# EAGLE design CT Bassline 3.0 (EAGLE 8.3.1)
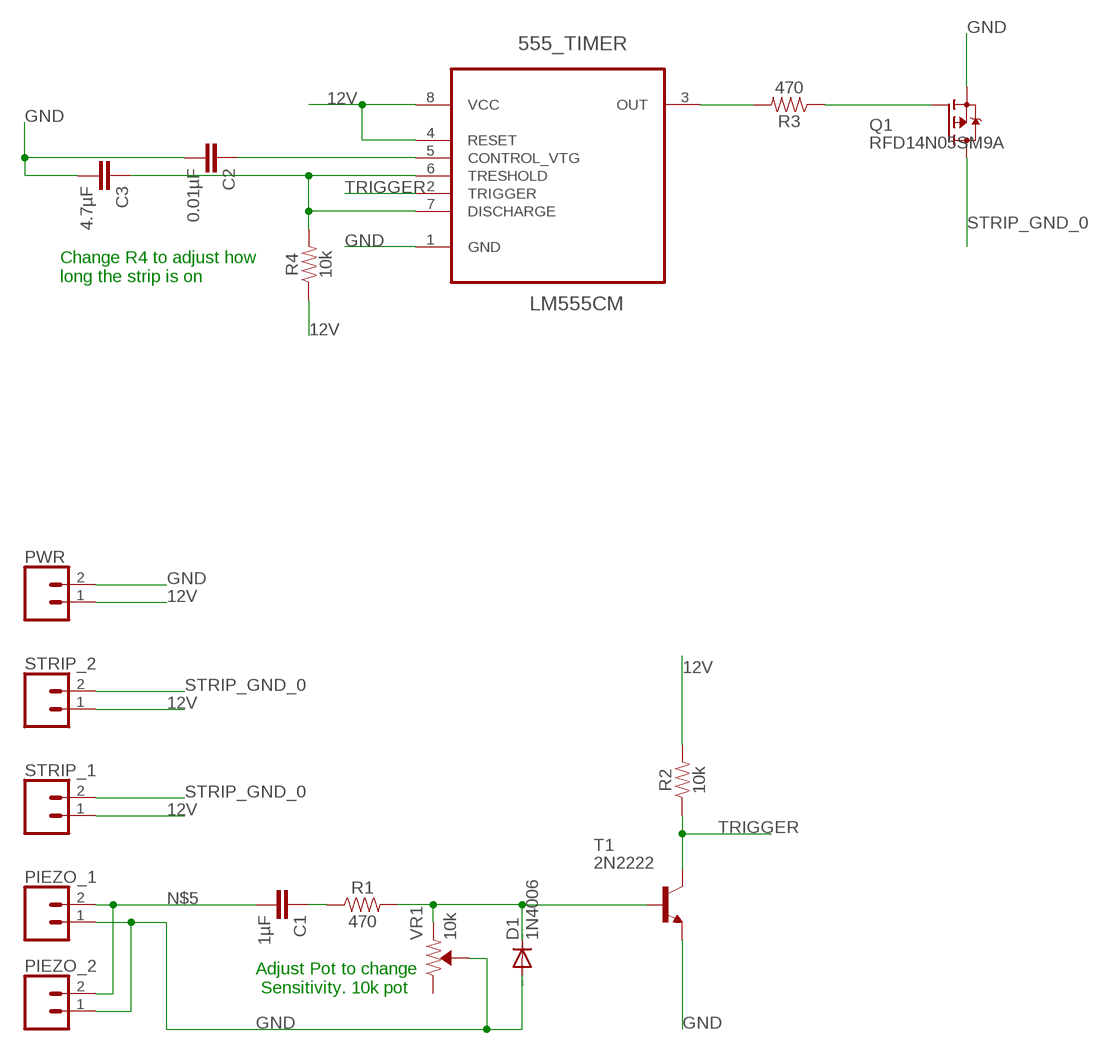
[diagram p0: schematic, sheet 1]

## Parts
555_TIMER  LM555CM  [SOIC127P600X175-8N]
C1  1µF  0.33UF/330NF-0805-50V-10%  [0805]
C2  0.01µF  0.33UF/330NF-0805-50V-10%  [0805]
C3  4.7µF  0.33UF/330NF-0805-50V-10%  [0805]
D1  1N4006  1N4004  [DO41-10]
PIEZO_1  CONN_02  [1X02]
PIEZO_2  CONN_02  [1X02]
PWR  CONN_02  [1X02]
Q1  RFD14N05SM9A  FDD4141TO252  [TO252]
R1  470  0.22OHM-0805-1/4W-1%  [0805]
R2  10k  0.22OHM-0805-1/4W-1%  [0805]
R3  470  0.22OHM-0805-1/4W-1%  [0805]
R4  10k  0.22OHM-0805-1/4W-1%  [0805]
STRIP_1  CONN_02  [1X02]
STRIP_2  CONN_02  [1X02]
T1  2N2222  [TO92-EBC-OVAL]
VR1  10k  TRIMPOT-PTH-10MM-KNOB-1/2W-10%  [TRIMPOT-PTH-3386U]

## Nets
12V: 555_TIMER.4(RESET) 555_TIMER.8(VCC) PWR.1 R2.2 R4.1 STRIP_1.1 STRIP_2.1
GATE: Q1.1(G) R3.1
GND: 555_TIMER.1(GND) C2.2 C3.2 D1.A PIEZO_1.1 PIEZO_2.1 PWR.2 Q1.2(S) T1.E VR1.2(WIPER)
N$1: C1.1 R1.1
N$3: 555_TIMER.3(OUT) R3.2
N$4: 555_TIMER.5(CONTROL_VTG) C2.1
N$5: C1.2 PIEZO_1.2 PIEZO_2.2
N$8: 555_TIMER.6(TRESHOLD) 555_TIMER.7(DISCHARGE) C3.1 R4.2
NO_CONNECT_TO_TRIGGER: D1.C R1.2 T1.B VR1.1(CCW)
STRIP_GND_0: Q1.3(D) STRIP_1.2 STRIP_2.2
TRIGGER: 555_TIMER.2(TRIGGER) R2.1 T1.C
Unconnected: VR1.3(CW)

## Notes on the sheet
- Change R4 to adjust how
  long the strip is on
- Adjust Pot to change
   Sensitivity. 10k pot

## Library data of the parts
555_TIMER = 555-Timer-Fairchild:LM555CM: Single Timer; MPN: LM555CM; OC_FARNELL: -; OC_NEWARK: 78K6011; PACKAGE: SOIC-8; SUPPLIER: FAIRCHILD
C1-C3 = SparkFun-Capacitors:0.33UF/330NF: 0.33µF/330nF ceramic capacitors A capacitor is a passive two-terminal electrical component used to store electrical energy temporarily in an electric field.; PROD_ID: CAP-08469; VALUE: 0.33µF
D1 = diode:1N4004: DIODE general purpose rectifier, 1 A
PIEZO_1 PIEZO_2 PWR STRIP_1 STRIP_2 = SparkFun-Connectors:CONN_02: Multi connection point. Often used as Generic Header-pin footprint for 0.1 inch spaced/style header connections On any of the 0.1 inch spaced packages, you can populate with these: Break Away Headers - Straight <https://www.sparkfun.com/products/116> (PRT-00116) Break Away Male Headers - Right Angle <https://www.sparkfun.com/products/553> (PRT-00553) Female Headers <https://www.sparkfun.com/products/115> (PRT-00115) Break Away Headers - Machine Pin <https://www.sparkfun.com/products/117> (PRT-00117) Break Away Female Headers - Swiss Machine Pin <https://www.sparkfun.com/products/743> (PRT-00743) For SCREWTERMINALS and SPRING TERMINALS visit here: Screw Terimnals on SparkFun.com <https://www.sparkfun.com/search/results?term=Screw+Terminals> (5mm/3.5mm/2.54mm spacing) This device is also useful as a general connection point to wire up your design to another part of your project. Our various solder wires solder well into these plated through hole pads. Hook-Up Wire - Assortment (Stranded, 22 AWG) <https://www.sparkfun.com/products/11375> (PRT-11375) Hook-Up Wire - Assortment (Solid Core, 22 AWG) <https://www.sparkfun.com/products/11367> (PRT-11367) View the entire wire category on our website here <https://www.sparkfun.com/categories/141> Special notes: Molex polarized connector foot print use with: PRT-08233 with associated crimp pins and housings. 2.54_SCREWTERM for use with PRT-10571. 3.5mm Screw Terminal footprints for PRT-08084 5mm Screw Terminal footprints for use with PRT-08432
Q1 = transistor-fet:FDD4141: P-Channel PowerTrench® MOSFET Source: FDD4141.pdf
R1-R4 = SparkFun-Resistors:0.22OHM: 0.22Ω resistor A resistor is a passive two-terminal electrical component that implements electrical resistance as a circuit element. Resistors act to reduce current flow, and, at the same time, act to lower voltage levels within circuits. - Wikipedia; PROD_ID: RES-09883; VALUE: 0.22
T1 = adafruit:2N2222: NPN TRANSISTOR Big oval pads
VR1 = SparkFun-Resistors:TRIMPOT: Trimming Potentiometer (Trimpot) Three-terminal potentiometers, with an adjustable wiper and two adjustable resistors. A pot can be used to create a configurable voltage divider, or as a variable resistor. "Trimpots" are a subset of potentiometers, usually intended for "set-and-forget" applications. They're often more delicate than standard potentiometers - rated for fewer turns. Variants PTH-KNOB - PTH Trimpot w/ finger-adjustable knob Trimpot 10K with Knob <https://www.sparkfun.com/products/9806> (COM-09806) Datasheet <http://www.sparkfun.com/datasheets/Components/General/TSR-3386.pdf> SMD-3MM-CLOSED-FRAME - SMD 3mm Square Closed-Frame Trimpot Used on e.g. EasyDriver - Stepper Motor Driver <https://www.sparkfun.com/products/12779> Datasheet <http://www.bitechnologies.com/pdfs/22.pdf> (22AR10KTR) SMD-5MM - SMD 5mm Square Closed-Frame Trimpot Used on e.g. IOIO-OTG - V2.2 <https://www.sparkfun.com/products/13613> Datasheet <http://www.vishay.com/docs/51008/ts53.pdf> (TS53YL502MR10) SMD-3MM-1/10W-25% - 3mm Square Open-Frame Trimpot Used on e.g. SparkFun Shapeoko <https://www.sparkfun.com/products/13899> Datasheet <http://www.bourns.com/docs/Product-Datasheets/TC33.pdf> (TC33X-2-103E); PROD_ID: RES-09730; SF_SKU: COM-09806

## Board
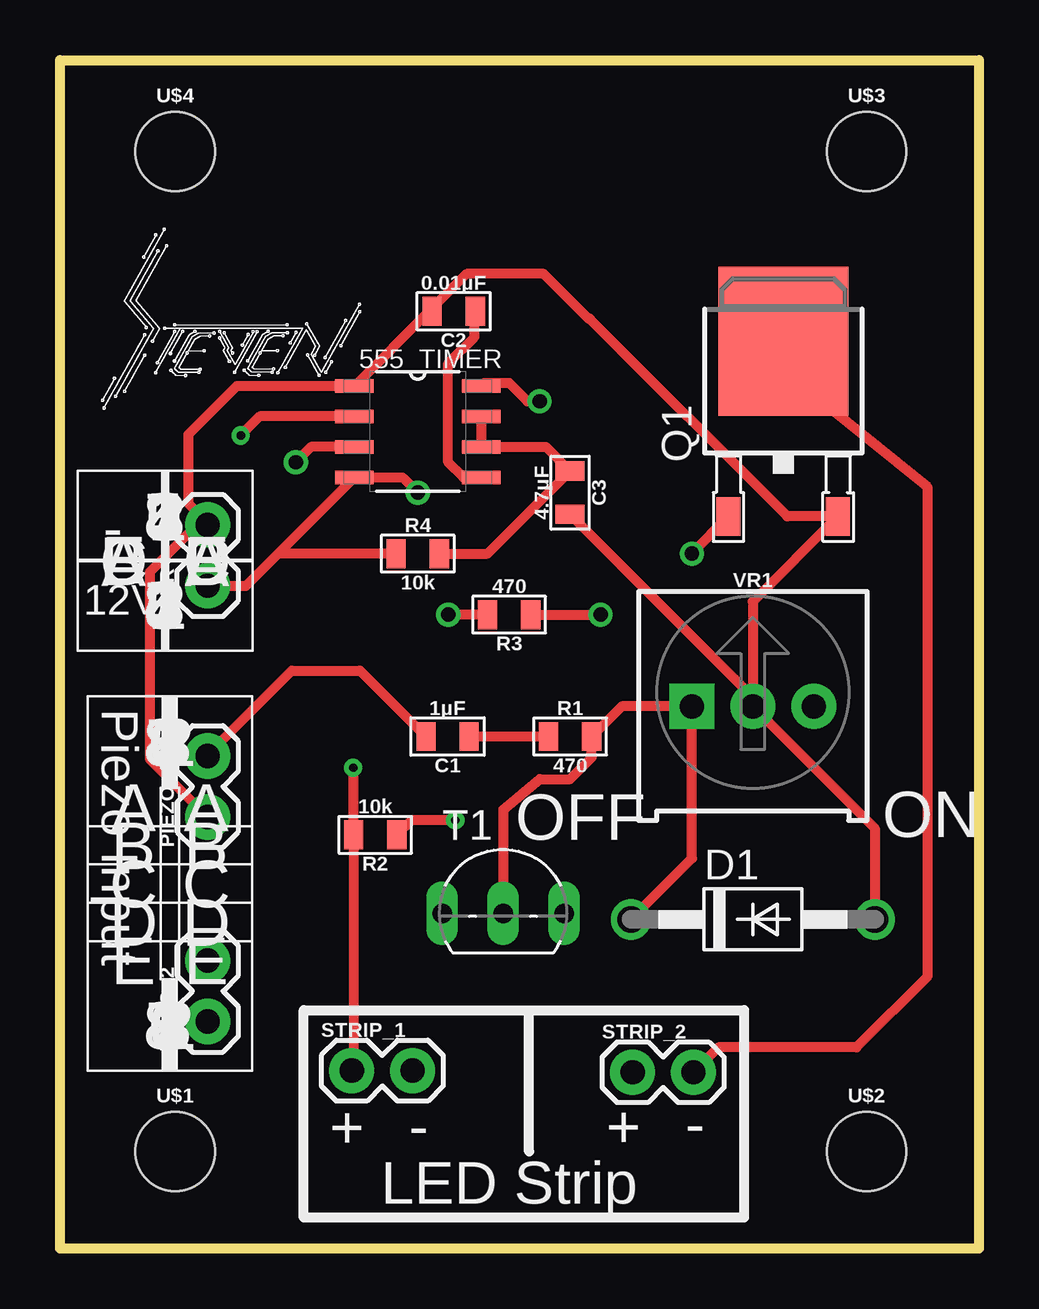
[diagram p1: board, top side]
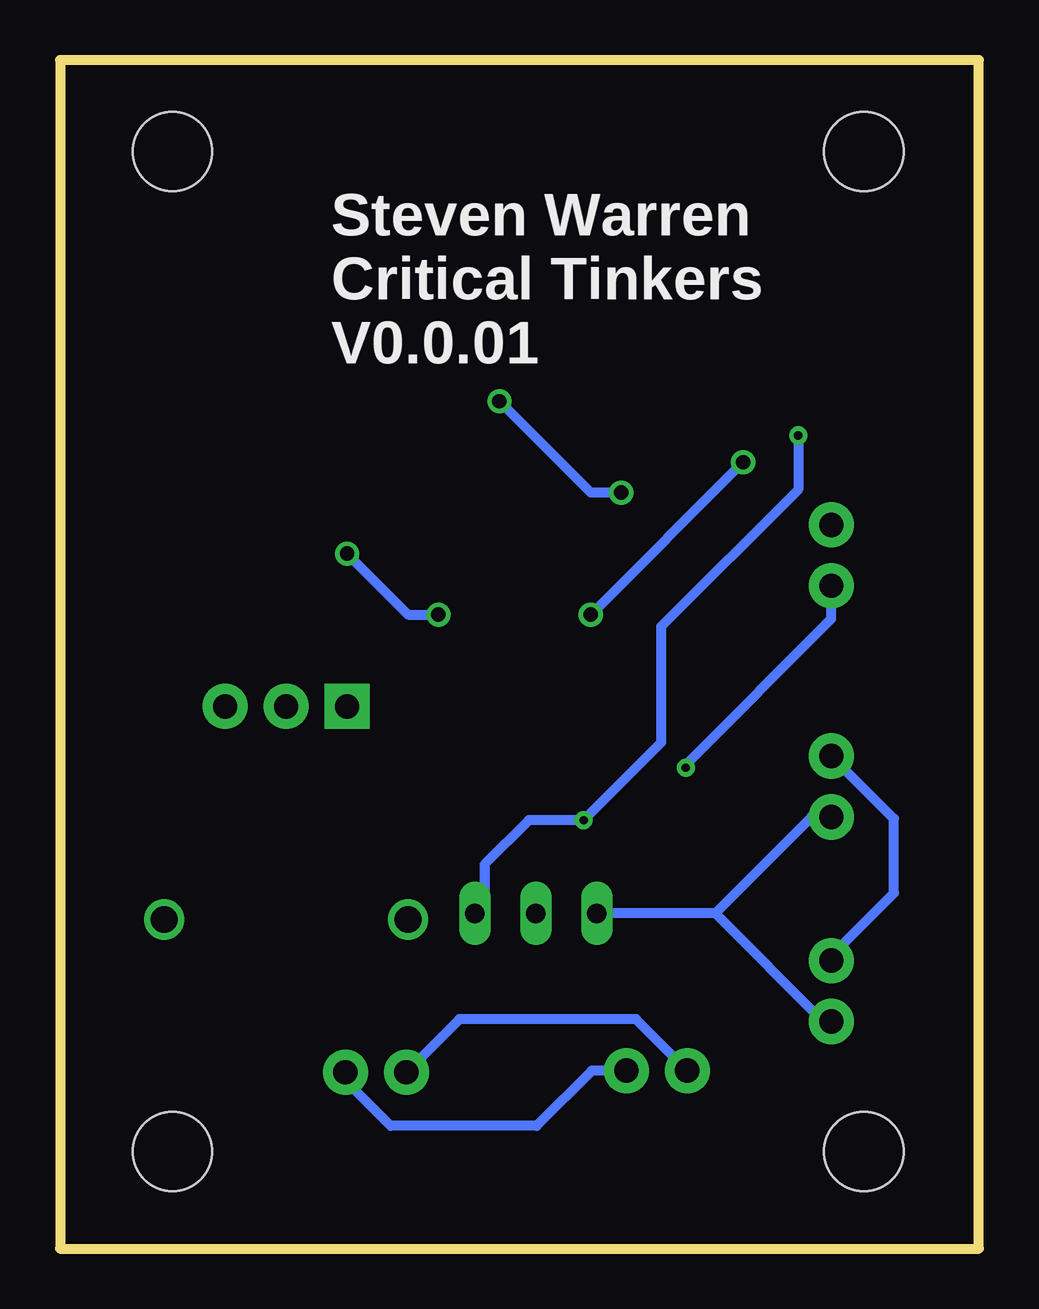
[diagram p2: board, bottom side, seen from below]

Size 38.31 x 49.53 mm. Coordinates in mm from the lower left corner, seen from the top.
Outline: 0,0 0,49.53 38.31,49.53 38.31,0 0,0
Copper layers (1*16): Top 0.035mm / dielectric 1.5mm / Bottom 0.035mm
Design rules "default": minimum track width 10mil, minimum drill 24mil, track to track 8mil, track to pad 8mil, pad to pad 8mil, via to via 8mil, smd to smd 8mil, copper to edge 40mil, drill to drill 8mil, minimum pad ring 10mil, minimum via ring 8mil, stop-mask expansion 4mil, vias tented up to drill 0mil, thermal gap 10mil

### Footprints (pad centres in the part's own frame; a part is rotated, then mirrored left to right if it is on the bottom)
SOIC127P600X175-8N = smd 1.6 x 0.559: 1 -2.642,1.905; 2 -2.642,0.635; 3 -2.642,-0.635; 4 -2.642,-1.905; 5 2.642,-1.905; 6 2.642,-0.635; 7 2.642,0.635; 8 2.642,1.905
0805 = smd 0.8 x 1.2: 1 -0.9,0; 2 0.9,0
DO41-10 = drill 1.118: A 5.08,0; C -5.08,0
1X02 = drill 1.016 pad 1.88: 1 0,0; 2 2.54,0
TO252 = smd 1 x 1.6: 1 -2.28,-4.8; 2 2.28,-4.8 | smd 5.4 x 6.2: 3 0,2.5
TO92-EBC-OVAL = drill 0.813 long: B 0,-1.27; C 2.54,-1.27; E -2.54,-1.27
STAND-OFF = hole 3.302: 0,0
TRIMPOT-PTH-3386U = drill 1.016 pad 1.88 square: 1 -2.54,-0.015 | drill 1.016 pad 1.88: 2 0,-0.015; 3 2.54,-0.015

### Placement (x,y rotation side)
555_TIMER  14.91,34.04 0 top
C1  16.15,21.34 180 top
C2  16.41,39.06 180 top
C3  21.26,31.5 270 top
D1  28.88,13.72 0 top
PIEZO_1  6.16,17.99 90 top
PIEZO_2  6.16,9.47 90 top
PWR  6.16,27.62 90 top
Q1  30.15,35.31 0 top
R1  21.26,21.34 0 top
R2  13.14,17.25 180 top
R3  18.72,26.42 180 top
R4  14.91,28.96 0 top
STRIP_1  12.16,7.42 0 top
STRIP_2  23.87,7.35 0 top
T1  18.47,15.25 0 top
U$1  [STAND-OFF]  4.8,4.05 0 top
U$2  [STAND-OFF]  33.63,4.05 0 top
U$3  [STAND-OFF]  33.63,45.72 0 top
U$4  [STAND-OFF]  4.8,45.72 0 top
VR1  28.88,22.61 0 top

### Tracks (layer width: path | path; a pad name or v marks a point on that pad's centre or on a via)
12V  (via drill 0.35, 0.6)
  Top 0.406: 18.09,35.95 555_TIMER.8 17.68,36.07 18.73,36.07 19.49,35.31 v20,35.31 | v14.91,31.5 14.28,32.14 555_TIMER.4 9.1,28.96 | PWR.1 7.76,27.62 9.1,28.96 | R4.1 9.1,28.96 | v12.22,20.04 12.22,17.27 R2.2 12.24,7.5 STRIP_1.1
  Bottom 0.406: v20,35.31 16.18,31.5 v14.91,31.5 | PWR.1 6.16,26.24 12.24,20.15 12.24,20.06 v12.22,20.04 | STRIP_1.1 14.3,9.56 21.66,9.56 STRIP_2.1
GATE  (via drill 0.6)
  Top 0.406: R3.1 v22.54,26.42 | v26.34,28.96 26.34,28.98 Q1.1
  Bottom 0.406: v26.34,28.96 23.8,26.42 v22.54,26.42
GND
  Top 0.406: VR1.2 28.89,26.96 Q1.2 30.32,30.51 22.1,38.73 | VR1.2 33.97,17.52 D1.A | 15.93,13.36 T1.E | PIEZO_1.1 3.74,20.4 3.74,28.19 5.71,30.16 PWR.2 6.2,30.21 5.35,31.07 5.35,33.92 7.37,35.95 555_TIMER.1 15.39,39.06 | VR1.2 28.89,22.98 C3.2 | 15.39,39.06 C2.2 | 22.1,38.73 22.08,38.76 | 22.1,38.73 22.05,38.73 20.16,40.62 16.95,40.62 15.39,39.06
  Bottom 0.406: PIEZO_1.1 6.99,17.99 11,13.98 | 11,13.98 T1.E | PIEZO_2.1 6.48,9.47 11,13.98
N$1
  Top 0.406: R1.1 C1.1
N$3  (via drill 0.6)
  Top 0.406: R3.2 v16.18,26.42 | 555_TIMER.3 10.47,33.41 v9.84,32.77
  Bottom 0.406: v16.18,26.42 v9.84,32.77
N$4
  Top 0.406: 555_TIMER.5 16.82,32.14 16.18,32.77 16.18,36.89 17.27,37.98 17.27,39.02 C2.1
N$5
  Top 0.406: PIEZO_1.2 6.16,20.58 9.66,24.09 12.51,24.09 C1.2
  Bottom 0.406: PIEZO_2.2 6.16,12.21 3.55,14.82 3.55,17.92 PIEZO_1.2
N$8
  Top 0.406: R4.2 17.82,28.96 C3.1 20.26,33.41 555_TIMER.6 555_TIMER.7
NO_CONNECT_TO_TRIGGER
  Top 0.406: T1.B 18.47,18.29 20,19.56 21.27,19.56 22.16,20.46 R1.2 23.42,22.6 VR1.1 26.34,16.26 D1.C
STRIP_GND_0
  Top 0.406: Q1.3 30.16,36.58 36.18,31.72 36.18,11.36 33.2,8.39 27.44,8.39 STRIP_2.2
  Bottom 0.406: 14.78,7.42 STRIP_1.2 16.14,7.42 18.44,5.12 24.52,5.12 26.41,7.01 STRIP_2.2
TRIGGER  (via drill 0.35)
  Top 0.406: 555_TIMER.2 8.33,34.68 v7.54,33.89 | v16.48,17.85 14.65,17.85 R2.1
  Bottom 0.406: v7.54,33.89 7.54,31.63 13.25,25.92 13.25,21.09 v16.48,17.85 18.76,17.85 20.6,16.01 20.6,14.38 T1.C

### Text on the board
tPlace: - | 12V | Piezo Input | OFF | ON | + | - | + | - | LED Strip
bNames: Steven Warren / Critical Tinkers / V0.0.01